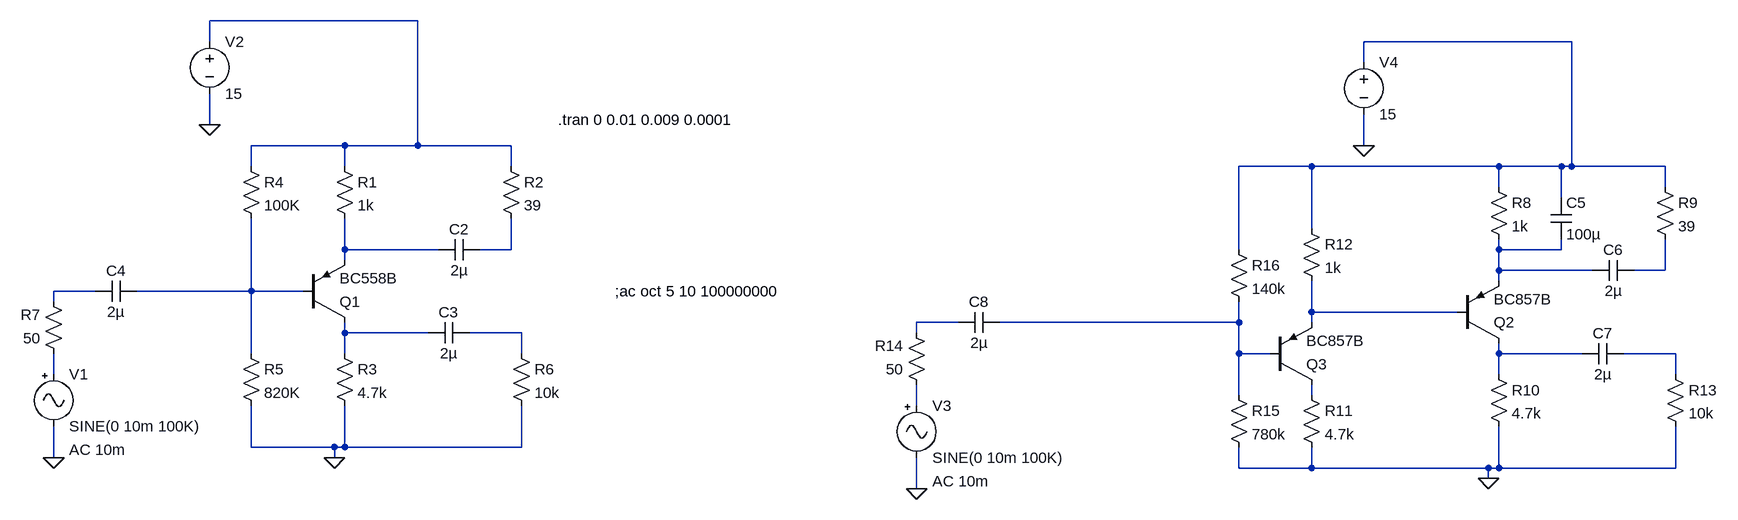
[diagram p0: schematic Citcuito1.asc]
Citcuito1.asc, the LTspice schematic file:
Version 4
SHEET 1 2340 680
WIRE 336 -432 16 -432
WIRE 16 -400 16 -432
WIRE 2112 -400 1792 -400
WIRE 1792 -368 1792 -400
WIRE 16 -272 16 -320
WIRE 224 -240 80 -240
WIRE 336 -240 336 -432
WIRE 336 -240 224 -240
WIRE 480 -240 336 -240
WIRE 1792 -240 1792 -288
WIRE 80 -208 80 -240
WIRE 224 -208 224 -240
WIRE 480 -208 480 -240
WIRE 1712 -208 1600 -208
WIRE 2000 -208 1712 -208
WIRE 2096 -208 2000 -208
WIRE 2112 -208 2112 -400
WIRE 2112 -208 2096 -208
WIRE 2256 -208 2112 -208
WIRE 2000 -176 2000 -208
WIRE 2256 -176 2256 -208
WIRE 2096 -160 2096 -208
WIRE 1712 -112 1712 -208
WIRE 224 -80 224 -128
WIRE 368 -80 224 -80
WIRE 480 -80 480 -128
WIRE 480 -80 432 -80
WIRE 1600 -80 1600 -208
WIRE 2000 -80 2000 -96
WIRE 2096 -80 2096 -96
WIRE 2096 -80 2000 -80
WIRE 224 -64 224 -80
WIRE 2000 -48 2000 -80
WIRE 2144 -48 2000 -48
WIRE 2256 -48 2256 -96
WIRE 2256 -48 2208 -48
WIRE 2000 -32 2000 -48
WIRE -160 -16 -224 -16
WIRE 80 -16 80 -128
WIRE 80 -16 -96 -16
WIRE 160 -16 80 -16
WIRE -224 0 -224 -16
WIRE 1712 16 1712 -32
WIRE 1936 16 1712 16
WIRE 1168 32 1104 32
WIRE 1600 32 1600 0
WIRE 1600 32 1232 32
WIRE 1712 32 1712 16
WIRE 224 48 224 32
WIRE 352 48 224 48
WIRE 496 48 416 48
WIRE 1104 48 1104 32
WIRE 80 80 80 -16
WIRE 224 80 224 48
WIRE 496 80 496 48
WIRE 1600 80 1600 32
WIRE 1648 80 1600 80
WIRE 2000 80 2000 64
WIRE 2128 80 2000 80
WIRE 2272 80 2192 80
WIRE -224 112 -224 80
WIRE 2000 112 2000 80
WIRE 2272 112 2272 80
WIRE 1600 144 1600 80
WIRE 1712 144 1712 128
WIRE 1104 160 1104 128
WIRE 80 224 80 160
WIRE 208 224 80 224
WIRE 224 224 224 160
WIRE 224 224 208 224
WIRE 496 224 496 160
WIRE 496 224 224 224
WIRE -224 240 -224 192
WIRE 208 240 208 224
WIRE 1600 256 1600 224
WIRE 1712 256 1712 224
WIRE 1712 256 1600 256
WIRE 1984 256 1712 256
WIRE 2000 256 2000 192
WIRE 2000 256 1984 256
WIRE 2272 256 2272 192
WIRE 2272 256 2000 256
WIRE 1984 272 1984 256
WIRE 1104 288 1104 240
FLAG -224 240 0
FLAG 208 240 0
FLAG 16 -272 0
FLAG 1104 288 0
FLAG 1984 272 0
FLAG 1792 -240 0
SYMBOL pnp 160 32 M180
SYMATTR InstName Q1
SYMATTR Value BC558B
SYMBOL res 208 -224 R0
SYMATTR InstName R1
SYMATTR Value 1k
SYMBOL res 464 -224 R0
SYMATTR InstName R2
SYMATTR Value 39
SYMBOL cap 432 -96 R90
WINDOW 0 0 32 VBottom 2
WINDOW 3 32 32 VTop 2
SYMATTR InstName C2
SYMATTR Value 2µ
SYMBOL res 208 64 R0
SYMATTR InstName R3
SYMATTR Value 4.7k
SYMBOL res 64 -224 R0
SYMATTR InstName R4
SYMATTR Value 100K
SYMBOL res 64 64 R0
SYMATTR InstName R5
SYMATTR Value 820K
SYMBOL cap 416 32 R90
WINDOW 0 0 32 VBottom 2
WINDOW 3 32 32 VTop 2
SYMATTR InstName C3
SYMATTR Value 2µ
SYMBOL res 480 64 R0
SYMATTR InstName R6
SYMATTR Value 10k
SYMBOL res -208 96 R180
WINDOW 0 36 76 Left 2
WINDOW 3 36 40 Left 2
SYMATTR InstName R7
SYMATTR Value 50
SYMBOL cap -96 -32 R90
WINDOW 0 0 32 VBottom 2
WINDOW 3 32 32 VTop 2
SYMATTR InstName C4
SYMATTR Value 2µ
SYMBOL Misc\\signal -224 96 R0
WINDOW 123 24 132 Left 2
WINDOW 39 0 0 Left 2
SYMATTR Value2 AC 10m
SYMATTR InstName V1
SYMATTR Value SINE(0 10m 100K)
SYMBOL voltage 16 -416 R0
WINDOW 123 0 0 Left 2
WINDOW 39 0 0 Left 2
SYMATTR InstName V2
SYMATTR Value 15
SYMBOL pnp 1936 64 M180
SYMATTR InstName Q2
SYMATTR Value BC857B
SYMBOL res 1984 -192 R0
SYMATTR InstName R8
SYMATTR Value 1k
SYMBOL res 2240 -192 R0
SYMATTR InstName R9
SYMATTR Value 39
SYMBOL cap 2080 -160 R0
SYMATTR InstName C5
SYMATTR Value 100µ
SYMBOL cap 2208 -64 R90
WINDOW 0 0 32 VBottom 2
WINDOW 3 32 32 VTop 2
SYMATTR InstName C6
SYMATTR Value 2µ
SYMBOL res 1984 96 R0
SYMATTR InstName R10
SYMATTR Value 4.7k
SYMBOL cap 2192 64 R90
WINDOW 0 0 32 VBottom 2
WINDOW 3 32 32 VTop 2
SYMATTR InstName C7
SYMATTR Value 2µ
SYMBOL res 2256 96 R0
SYMATTR InstName R13
SYMATTR Value 10k
SYMBOL res 1120 144 R180
WINDOW 0 36 76 Left 2
WINDOW 3 36 40 Left 2
SYMATTR InstName R14
SYMATTR Value 50
SYMBOL cap 1232 16 R90
WINDOW 0 0 32 VBottom 2
WINDOW 3 32 32 VTop 2
SYMATTR InstName C8
SYMATTR Value 2µ
SYMBOL Misc\\signal 1104 144 R0
WINDOW 123 24 132 Left 2
WINDOW 39 0 0 Left 2
SYMATTR Value2 AC 10m
SYMATTR InstName V3
SYMATTR Value SINE(0 10m 100K)
SYMBOL voltage 1792 -384 R0
WINDOW 123 0 0 Left 2
WINDOW 39 0 0 Left 2
SYMATTR InstName V4
SYMATTR Value 15
SYMBOL pnp 1648 128 M180
SYMATTR InstName Q3
SYMATTR Value BC857B
SYMBOL res 1696 128 R0
SYMATTR InstName R11
SYMATTR Value 4.7k
SYMBOL res 1696 -128 R0
SYMATTR InstName R12
SYMATTR Value 1k
SYMBOL res 1584 128 R0
SYMATTR InstName R15
SYMATTR Value 780k
SYMBOL res 1584 -96 R0
SYMATTR InstName R16
SYMATTR Value 140k
TEXT 552 -280 Left 2 !.tran 0 0.01 0.009 0.0001
TEXT 640 -16 Left 2 !;ac oct 5 10 100000000

The netlist it stands for:
* Citcuito1.asc
Q1 N012 N008 N003 0 BC558B
R1 N001 N003 1k
R2 N001 N004 39
C2 N004 N003 2µ
R3 N012 0 4.7k
R4 N001 N008 100K
R5 N008 0 820K
C3 N013 N012 2µ
R6 N013 0 10k
R7 N016 N007 50
C4 N008 N007 2µ
V1 N016 0 SINE(0 10m 100K) AC 10m
V2 N001 0 15
Q2 N014 N009 N005 0 BC857B
R8 N002 N005 1k
R9 N002 N006 39
C5 N002 N005 100µ
C6 N006 N005 2µ
R10 N014 0 4.7k
C7 N015 N014 2µ
R13 N015 0 10k
R14 N018 N010 50
C8 N011 N010 2µ
V3 N018 0 SINE(0 10m 100K) AC 10m
V4 N002 0 15
Q3 N017 N011 N009 0 BC857B
R11 N017 0 4.7k
R12 N002 N009 1k
R15 N011 0 780k
R16 N002 N011 140k
.model NPN NPN
.model PNP PNP
.lib standard.bjt
.tran 0 0.01 0.009 0.0001
;ac oct 5 10 100000000
.backanno
.end